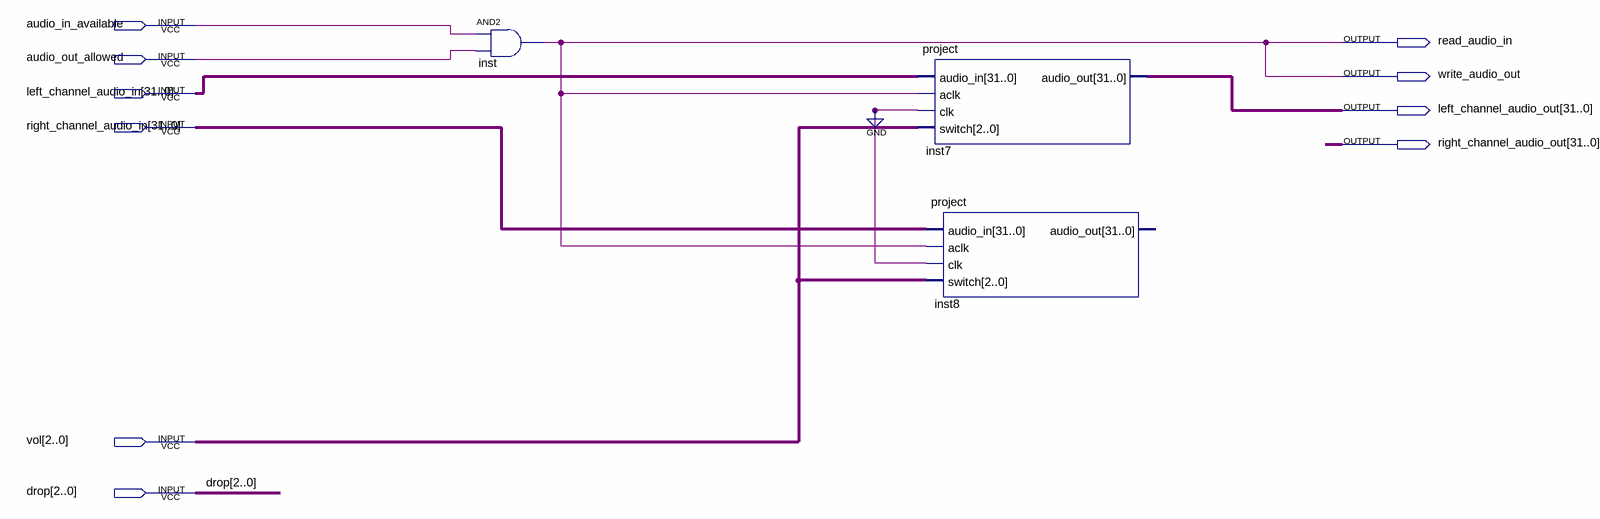
[diagram p0: schematic sheet]
// Quartus schematic filter_demo.bdf as structural Verilog: 3 symbols, 10 pins
module filter_demo (
  input  audio_in_available,
  input  audio_out_allowed,
  input  [31:0] left_channel_audio_in,
  input  [31:0] right_channel_audio_in,
  input  [2:0] vol,
  input  [2:0] drop,
  output read_audio_in,
  output write_audio_out,
  output [31:0] left_channel_audio_out,
  output [31:0] right_channel_audio_out
);

  and inst (read_audio_in, audio_in_available, audio_out_allowed);
  project inst7 (
    .audio_in(left_channel_audio_in), .aclk(read_audio_in), .clk(1'b0), .switch(vol),
    .audio_out(left_channel_audio_out));
  project inst8 (.audio_in(right_channel_audio_in), .aclk(read_audio_in), .clk(1'b0), .switch(vol));  // open: audio_out

  assign write_audio_out = read_audio_in;
endmodule
